# EAGLE design attinier85-power-shield-mk-1.0 (EAGLE 6.5.0)
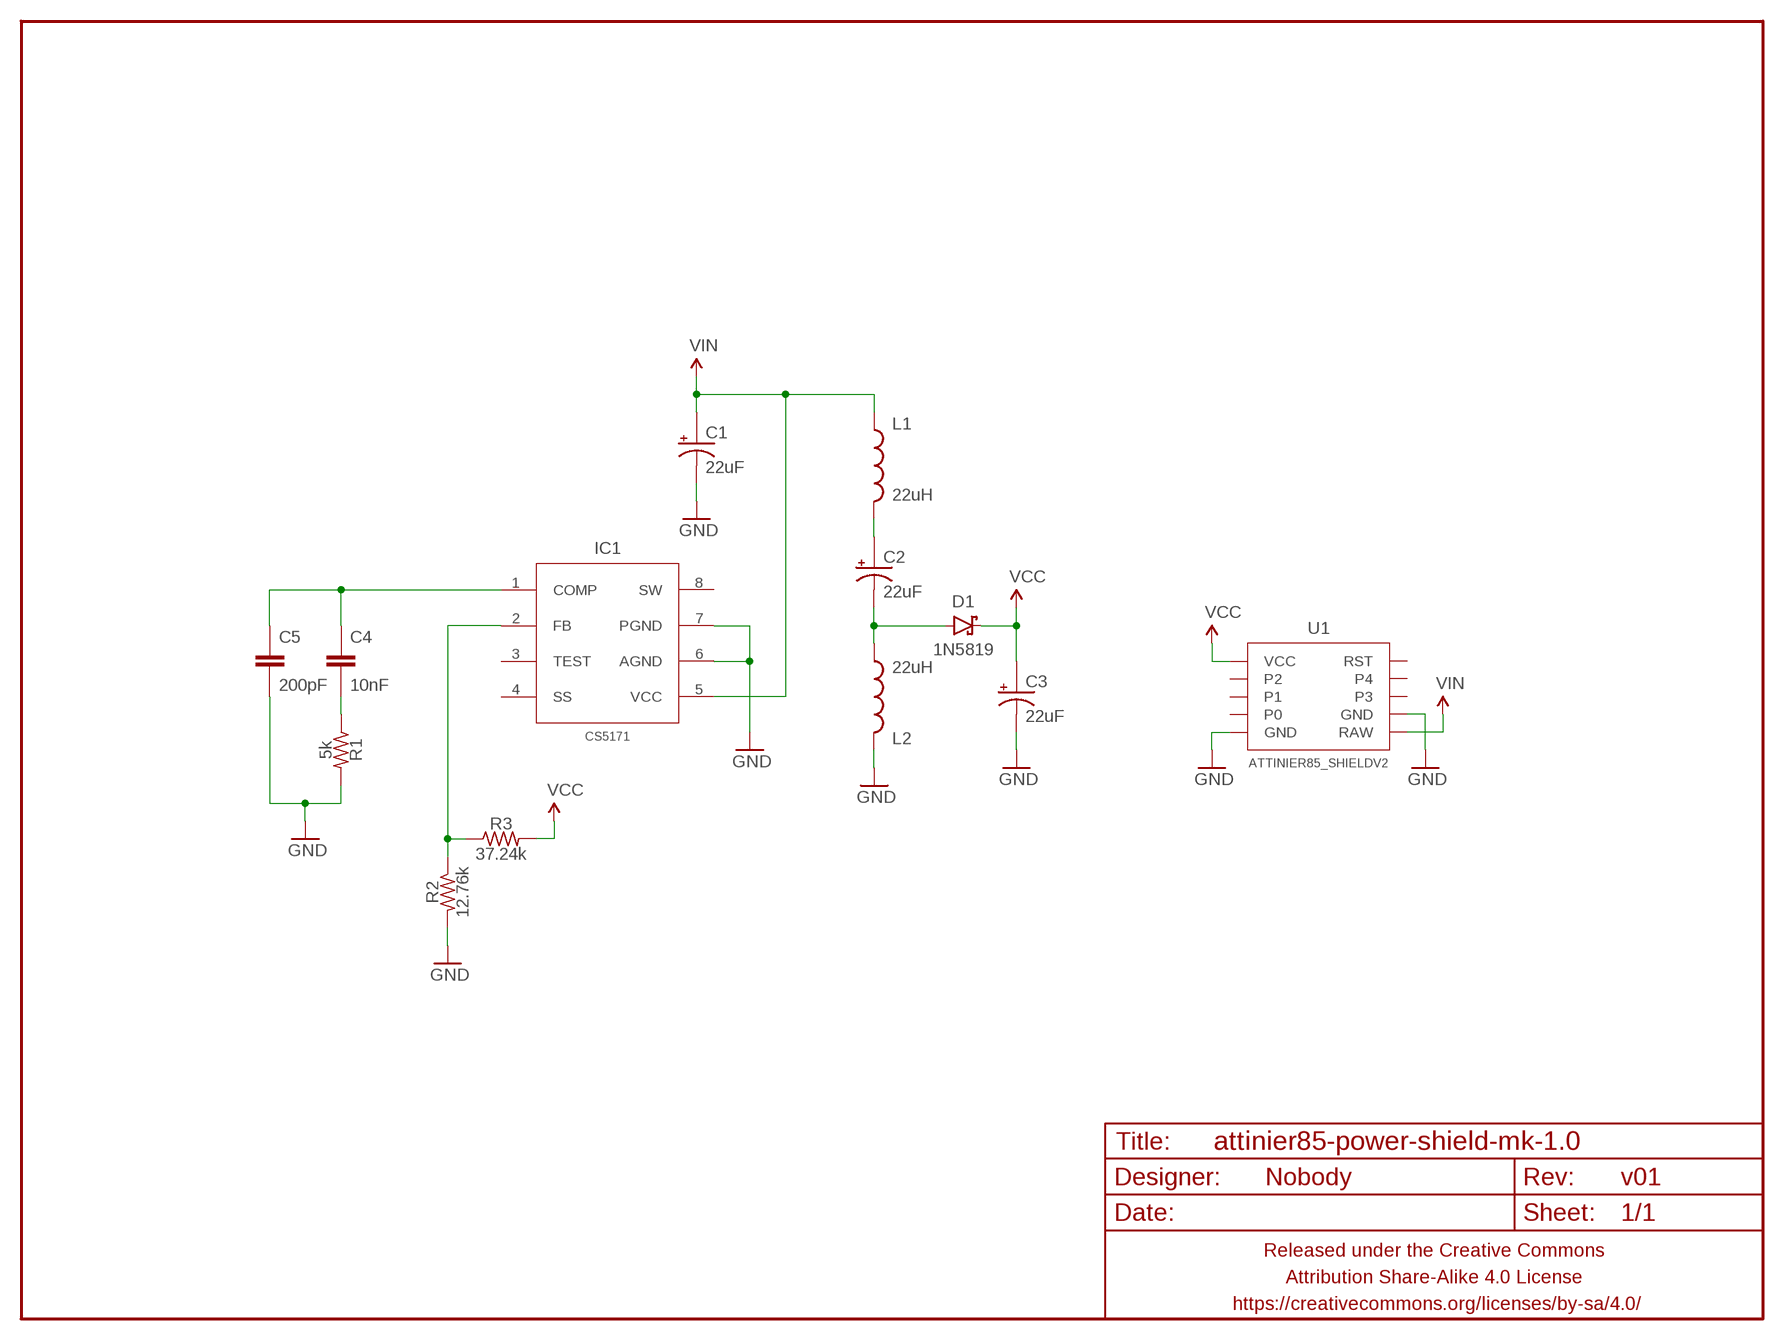
[diagram p0: schematic, sheet 1]

## Parts
C1  22uF  CAPACITOR-POLARIZEDE2.5-6  [E2,5-6]
C2  22uF  CAPACITOR-POLARIZEDE2.5-6  [E2,5-6]
C3  22uF  CAPACITOR-POLARIZEDE2.5-6  [E2,5-6]
C4  10nF  CAPACITOR-CERAMIC025-024X044  [C025-024X044]
C5  200pF  CAPACITOR-CERAMIC025-024X044  [C025-024X044]
D1  1N5819  DIODE-SCHOTTKYPTH-10.16MM  [DIODE-10.16MM]
FRAME1  FRAME-LETTERNO_PACKAGE  [DUMMY]
IC1  CS5171  CS5171/3SOIC-CS5171  [SO08]
L1  22uH  INDUCTORAXIAL-PTH-10.16MM  [INDUCTOR-AXIAL-PTH-10.16MM]
L2  22uH  INDUCTORAXIAL-PTH-10.16MM  [INDUCTOR-AXIAL-PTH-10.16MM]
R1  5k  RESISTORPTH-AXIAL-6.35MM  [RESISTOR-AXIAL-PTH-6.35MM]
R2  12.76k  RESISTORPTH-AXIAL-6.35MM  [RESISTOR-AXIAL-PTH-6.35MM]
R3  37.24k  RESISTORPTH-AXIAL-6.35MM  [RESISTOR-AXIAL-PTH-6.35MM]
U1  ATTINIER85_SHIELDV2  [ATTINIER85_SHIELD_V2]

## Nets
GND: C1.- C3.- C5.2 IC1.6(AGND) IC1.7(PGND) L2.P$1 R1.P$2 R2.P$2 U1.GND@1(GND) U1.GND@2(GND)
N$1: C4.2 R1.P$1
N$3: C4.1 C5.1 IC1.1(COMP)
N$4: IC1.2(FB) R2.P$1 R3.P$1
N$6: C2.+ L1.P$2
N$7: C2.- D1.A L2.P$2
VCC: C3.+ D1.C R3.P$2 U1.VCC
VIN: C1.+ IC1.5(VCC) L1.P$1 U1.RAW
Unconnected: IC1.3(TEST) IC1.4(SS) IC1.8(SW) U1.0 U1.1 U1.2 U1.3 U1.4 U1.RST

## Library data of the parts
C1-C3 = A_butts:CAPACITOR-POLARIZED: POLARIZED CAPACITOR, American symbol
C4 C5 = A_butts:CAPACITOR-CERAMIC: CAPACITOR, European symbol
D1 = A_butts:DIODE-SCHOTTKY: Schottky diodes in SFE's production catalog BAT20J 1A 23V 0.62Vf RB751 120mA 40V 0.37Vf PMEG4005EJ 0.5A 40V 0.42Vf MBRA140 1A 40V 0.5Vf B340A 3A 40V SMA
FRAME1 = A_butts:FRAME-LETTER: Schematic Frame Standard 8.5x11 US Letter frame; DESIGNER: Nobody; VERSION: v01
IC1 = A_butts:CS5171/3
L1 L2 = A_butts:INDUCTOR: Inductors Basic Inductor/Choke - 0603 and 1206. Footprints are not proven and vary greatly between part numbers. SRN6045- 33uH, 20% 1.4A SDR0403-560KL - 56uH, 10%, 500mA RMS/740mA peak
R1-R3 = A_butts:RESISTOR: RESISTOR, American symbol
U1 = A_butts:ATTINIER85_SHIELD

## Board
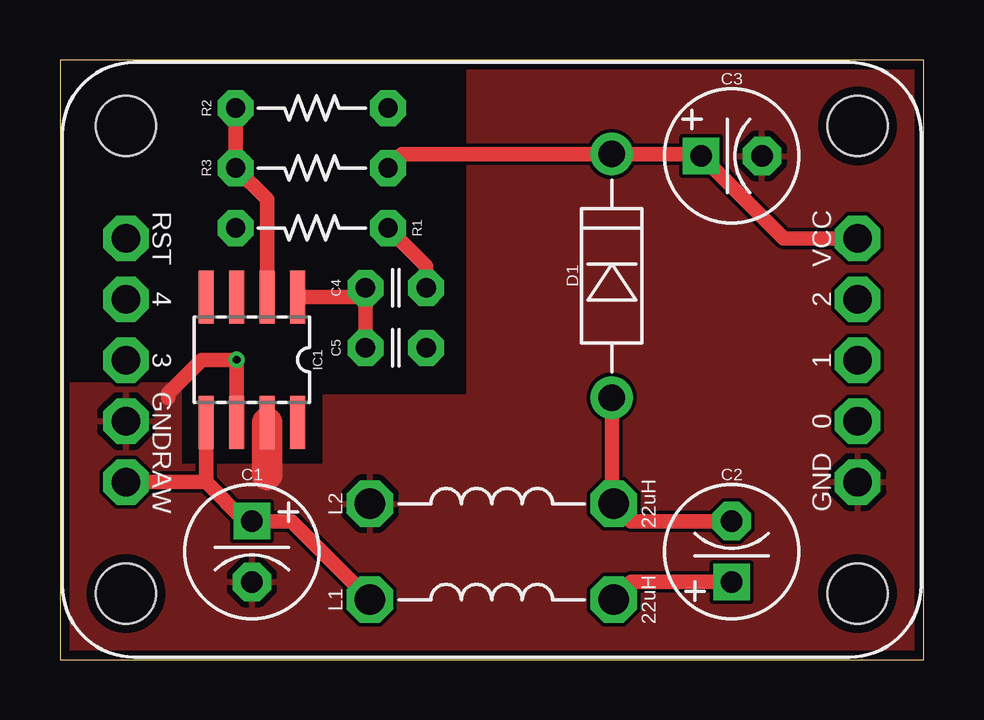
[diagram p1: board, top side]
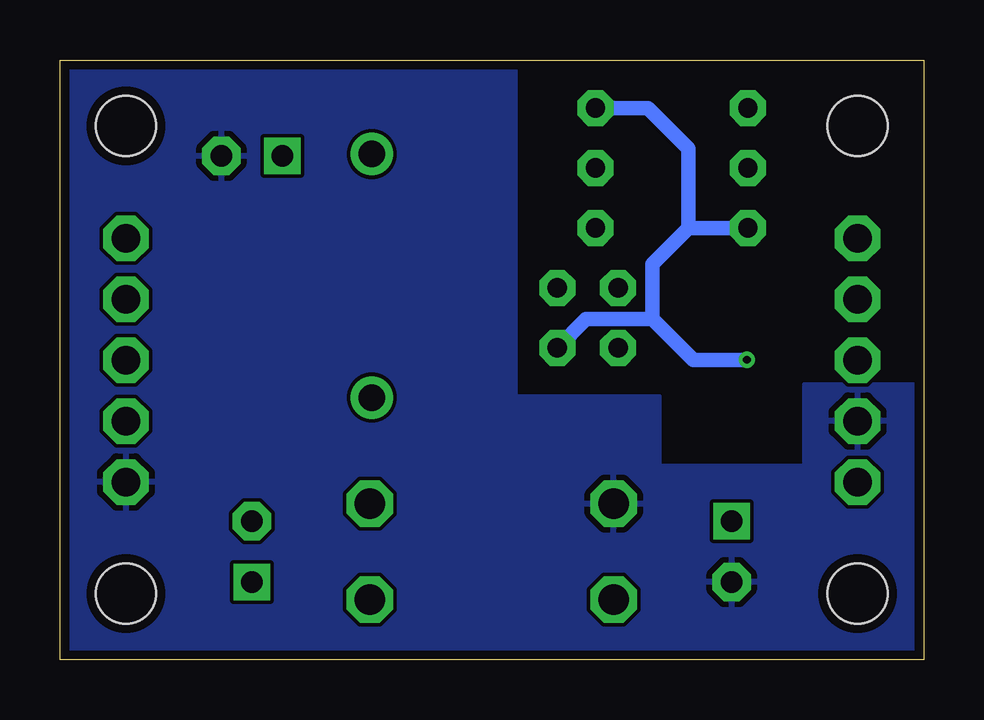
[diagram p2: board, bottom side, seen from below]

Size 36 x 25 mm. Coordinates in mm from the lower left corner, seen from the top.
Outline: 0,0 36,0 36,25 0,25 0,0
Copper layers (1*16): Top 0.0356mm / dielectric 1.5011mm / Bottom 0.0356mm
Design rules "LaenPCBOrder_2": minimum track width 6mil, minimum drill 13mil, track to track 6mil, track to pad 6mil, pad to pad 6mil, via to via 6mil, smd to smd 6mil, copper to edge 15mil, drill to drill 6mil, minimum pad ring 7mil, minimum via ring 7mil, stop-mask expansion 3mil, vias tented up to drill 20mil, thermal gap 10mil

### Footprints (pad centres in the part's own frame; a part is rotated, then mirrored left to right if it is on the bottom)
E2,5-6 = drill 0.9 pad 1.524 square: + -1.27,0 | drill 0.9 pad 1.6 octagon: - 1.27,0
C025-024X044 = drill 0.813 pad 1.5 octagon: 1 -1.27,0; 2 1.27,0
DIODE-10.16MM = drill 1.1 pad 1.778: A -5.08,0; C 5.08,0
SO08 = smd 0.61 x 2.21: 1 -1.905,-2.616; 2 -0.635,-2.616; 3 0.635,-2.616; 4 1.905,-2.616; 5 1.905,2.616; 6 0.635,2.616; 7 -0.635,2.616; 8 -1.905,2.616
INDUCTOR-AXIAL-PTH-10.16MM = drill 1.27 pad 1.93 octagon: P$1 -5.08,0; P$2 5.08,0
RESISTOR-AXIAL-PTH-6.35MM = drill 0.8 pad 1.5 octagon: P$1 -3.175,0; P$2 3.175,0
ATTINIER85_SHIELD_V2 = drill 1.2 pad 1.9 octagon: 0 15.25,-2.56; 1 15.25,-0.02; 2 15.25,2.52; 3 -15.25,-0.02; 4 -15.25,2.52; GND@1 -15.25,-2.56; GND@2 15.25,-5.1; RAW -15.25,-5.1; RST -15.25,5.06; VCC 15.25,5.06 | hole 2.5: -15.25,-9.75; -15.25,9.75; 15.25,9.75; 15.25,-9.75

### Placement (x,y rotation side)
C1  8,4.5 270 top
C2  28,4.5 90 top
C3  28,21 0 top
C4  14,15.5 0 top
C5  14,13 0 top
D1  23,16 90 top
FRAME1  0,0 0 top
IC1  8,12.5 180 top
L1  18,2.5 0 top
L2  18,6.5 0 top
R1  10.5,18 180 top
R2  10.5,23 0 top
R3  10.5,20.5 0 top
U1  18,12.5 0 top

### Tracks (layer width: path | path; a pad name or v marks a point on that pad's centre or on a via)
GND  (via drill 0.33)
  Top 0.6: IC1.6 v7.37,12.5 5.9,12.5 4.5,11.1 4.5,10.9
  Top 1.27: IC1.7 8.63,7.7
  Bottom 0.6: v7.37,12.5 9.6,12.5 11.3,14.2 | 11.3,14.2 14.07,14.2 C5.2 | R1.P$2 9.8,18 | 9.8,18 11.3,16.5 11.3,14.2 | 9.8,18 9.8,21.3 11.5,23 R2.P$2
  pour Top: 36.1,-0.1 -0.1,-0.1 -0.1,11.5 5,11.5 5,8.1 11,8.1 11,11 17,11 17,25.1 36.1,25.1
  pour Bottom: 36.1,-0.1 -0.1,-0.1 -0.1,11.5 5,11.5 5,8.1 11,8.1 11,11 17,11 17,25.1 36.1,25.1
N$1
  Top 0.6: C4.2 15.27,16.41 R1.P$1
N$3
  Top 0.6: C5.1 C4.1 12.35,15.12 IC1.1
N$4
  Top 0.6: IC1.2 8.63,19.19 R3.P$1 R2.P$1
N$6
  Top 0.6: C2.+ 23.81,3.23 L1.P$2
N$7
  Top 0.6: D1.A 23,6.58 L2.P$2 23.81,5.77 C2.-
VCC
  Top 0.6: R3.P$2 14.26,21.08 D1.C 26.65,21.08 C3.+ 30.17,17.56 U1.VCC
VIN
  Top 0.6: U1.RAW 6.09,7.4 | 6.09,7.4 IC1.5 | 6.09,7.4 7.72,5.77 C1.+ 9.65,5.77 L1.P$1